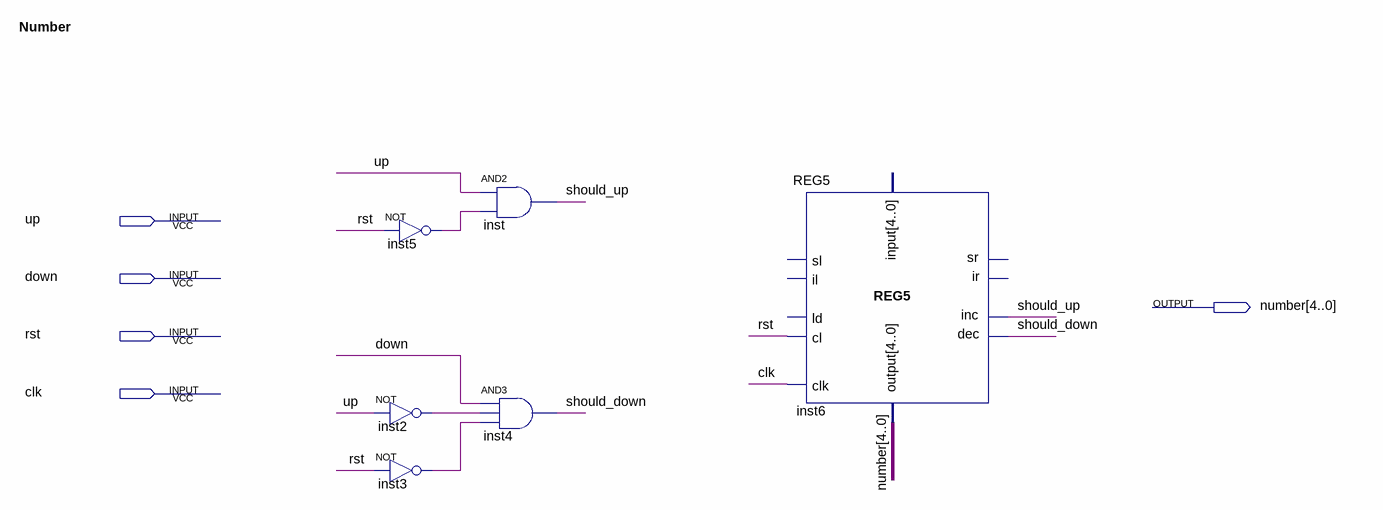
[diagram p0: schematic sheet]
// Quartus schematic Number.bdf as structural Verilog: 6 symbols, 5 pins
module Number (
  input  up,
  input  down,
  input  rst,
  input  clk,
  output [4:0] number
);

  wire inst2_out, inst3_out, inst5_out, should_down, should_up;

  not inst5 (inst5_out, rst);
  not inst2 (inst2_out, up);
  not inst3 (inst3_out, rst);
  and inst (should_up, up, inst5_out);
  and inst4 (should_down, down, inst2_out, inst3_out);
  REG5 inst6 (
    .clk(clk), .inc(should_up), .dec(should_down), .cl(rst), .\output (number));  // open: ld, input, sr, ir, sl, il

  // Notes on the sheet:
  //   Number
endmodule
